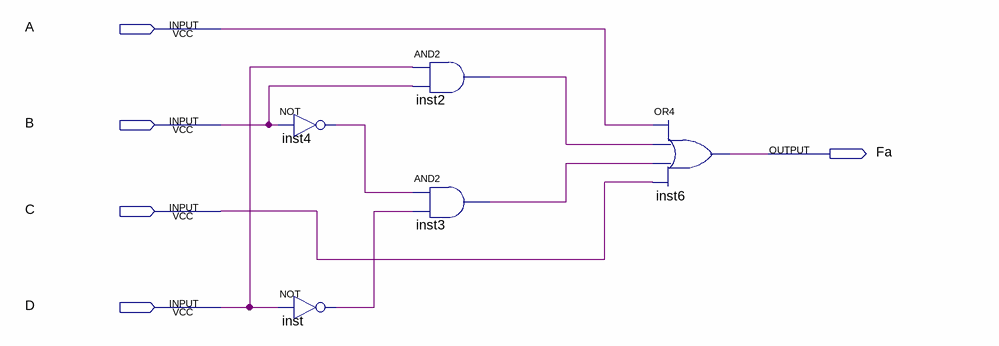
[diagram p0: schematic sheet]
// Quartus schematic Fa.bdf as structural Verilog: 5 symbols, 5 pins
module Fa (
  input  A,
  input  B,
  input  C,
  input  D,
  output Fa
);

  wire inst2_out, inst3_out, inst4_out, inst_out;

  not inst4 (inst4_out, B);
  not inst (inst_out, D);
  and inst2 (inst2_out, D, B);
  and inst3 (inst3_out, inst4_out, inst_out);
  or inst6 (Fa, A, inst2_out, inst3_out, C);
endmodule
